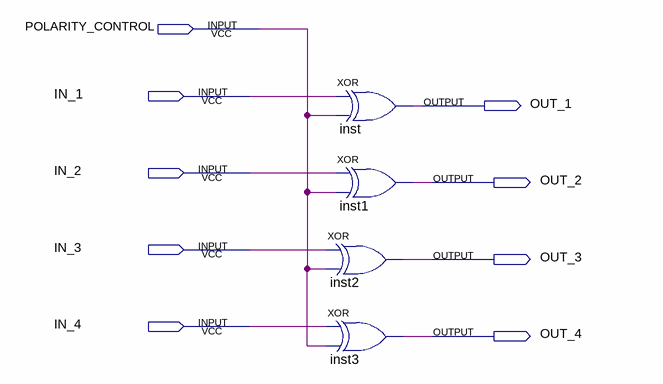
[diagram p0: schematic sheet]
// Quartus schematic polarity_schem.bdf as structural Verilog: 4 symbols, 9 pins
module polarity_schem (
  input  POLARITY_CONTROL,
  input  IN_1,
  input  IN_2,
  input  IN_3,
  input  IN_4,
  output OUT_1,
  output OUT_2,
  output OUT_3,
  output OUT_4
);

  xor inst (OUT_1, IN_1, POLARITY_CONTROL);
  xor inst1 (OUT_2, IN_2, POLARITY_CONTROL);
  xor inst2 (OUT_3, IN_3, POLARITY_CONTROL);
  xor inst3 (OUT_4, IN_4, POLARITY_CONTROL);
endmodule
